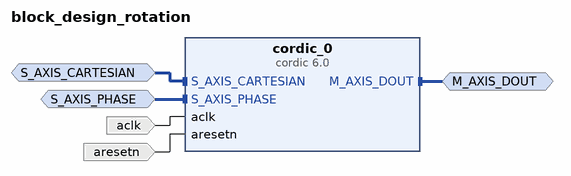
[diagram p0: block diagram of the top level]
# Vivado block design block_design_rotation, xc7z020clg484-1, Vivado 2023.2.2
create_bd_design block_design_rotation

create_bd_intf_port -mode Master -vlnv xilinx.com:interface:axis_rtl:1.0 M_AXIS_DOUT
set_property -dict {CONFIG.FREQ_HZ 1000000} [get_bd_intf_ports M_AXIS_DOUT]
create_bd_intf_port -mode Slave -vlnv xilinx.com:interface:axis_rtl:1.0 S_AXIS_CARTESIAN
set_property -dict [list \
  CONFIG.FREQ_HZ 1000000 \
  CONFIG.HAS_TKEEP 0 \
  CONFIG.HAS_TLAST 1 \
  CONFIG.HAS_TREADY 0 \
  CONFIG.HAS_TSTRB 0 \
  CONFIG.LAYERED_METADATA undef \
  CONFIG.TDATA_NUM_BYTES 4 \
  CONFIG.TDEST_WIDTH 0 \
  CONFIG.TID_WIDTH 0 \
  CONFIG.TUSER_WIDTH 0 \
] [get_bd_intf_ports S_AXIS_CARTESIAN]
create_bd_intf_port -mode Slave -vlnv xilinx.com:interface:axis_rtl:1.0 S_AXIS_PHASE
set_property -dict [list \
  CONFIG.FREQ_HZ 1000000 \
  CONFIG.HAS_TKEEP 0 \
  CONFIG.HAS_TLAST 0 \
  CONFIG.HAS_TREADY 0 \
  CONFIG.HAS_TSTRB 0 \
  CONFIG.LAYERED_METADATA undef \
  CONFIG.TDATA_NUM_BYTES 2 \
  CONFIG.TDEST_WIDTH 0 \
  CONFIG.TID_WIDTH 0 \
  CONFIG.TUSER_WIDTH 0 \
] [get_bd_intf_ports S_AXIS_PHASE]
create_bd_port -dir I -type clk aclk
set_property -dict {CONFIG.FREQ_HZ 1000000} [get_bd_ports aclk]
create_bd_port -dir I -type rst aresetn

create_bd_cell -type ip -vlnv xilinx.com:ip:cordic:6.0 cordic_0
set_property -dict [list \
  CONFIG.ARESETN true \
  CONFIG.Phase_Format Scaled_Radians \
  CONFIG.cartesian_has_tlast true \
  CONFIG.out_tlast_behv Pass_Cartesian_TLAST \
] [get_bd_cells cordic_0]

# ---- connections ----

connect_bd_intf_net -intf_net S_AXIS_CARTESIAN_0_1 [get_bd_intf_ports S_AXIS_CARTESIAN] [get_bd_intf_pins cordic_0/S_AXIS_CARTESIAN]
connect_bd_intf_net -intf_net S_AXIS_PHASE_0_1 [get_bd_intf_ports S_AXIS_PHASE] [get_bd_intf_pins cordic_0/S_AXIS_PHASE]
connect_bd_intf_net [get_bd_intf_ports M_AXIS_DOUT] [get_bd_intf_pins cordic_0/M_AXIS_DOUT]
connect_bd_net -net aclk_0_1 [get_bd_ports aclk] [get_bd_pins cordic_0/aclk]
connect_bd_net -net aresetn_0_1 [get_bd_ports aresetn] [get_bd_pins cordic_0/aresetn]

validate_bd_design
save_bd_design
